# EAGLE design sdi-master (EAGLE 9.3.0)
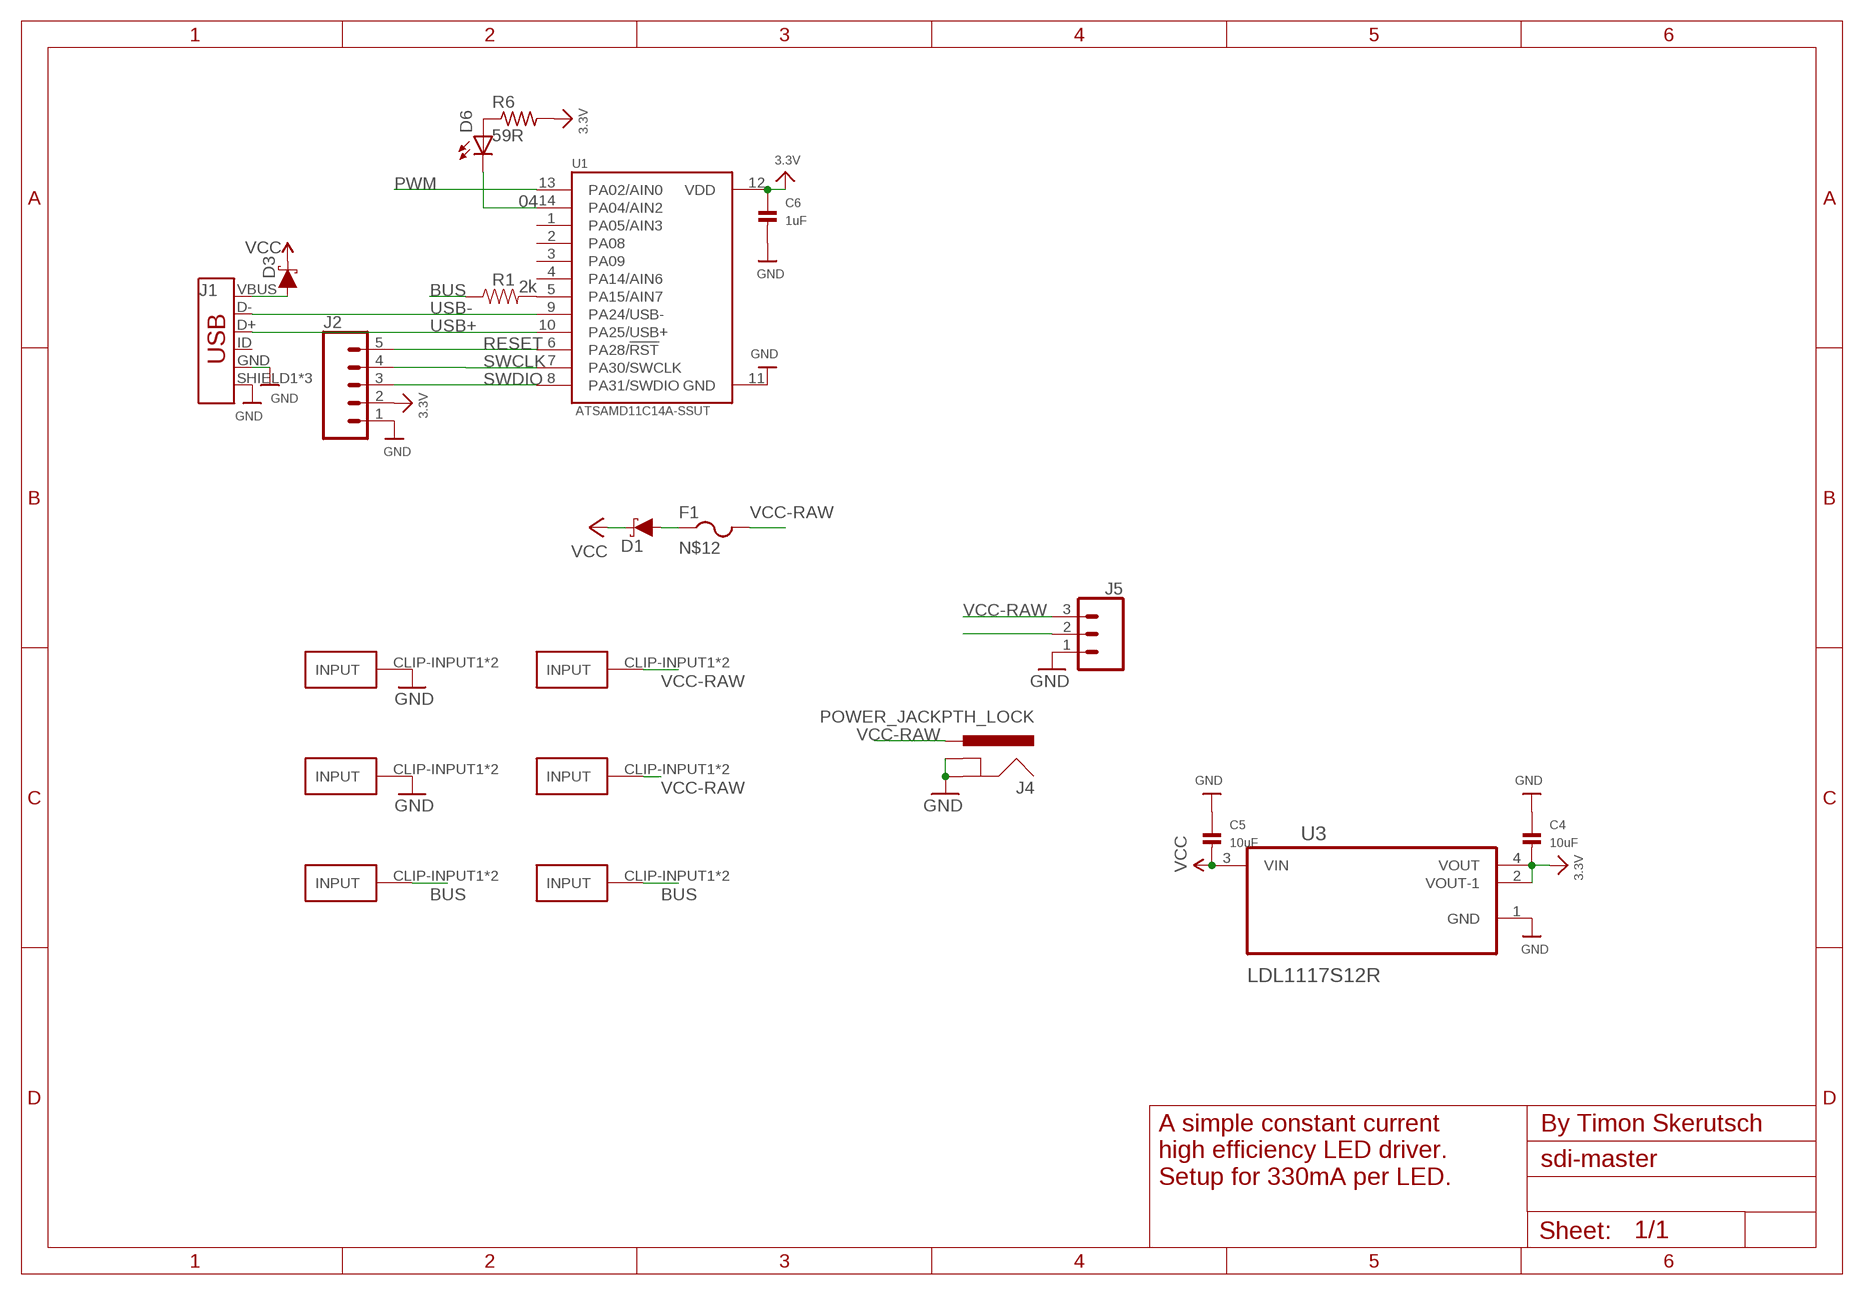
[diagram p0: schematic, sheet 1]

## Parts
C4  10uF  CAP_CERAMIC0805  [0805]
C5  10uF  CAP_CERAMIC0603  [0603]
C6  1uF  CAP_CERAMIC0603  [0603]
D1  3A/40V/500mV  DIODE-SCHOTTKY-B340A  [SMA-DIODE]
D3  3A/40V/500mV  DIODE-SCHOTTKY-B340A  [SMA-DIODE]
D6  LEDCHIPLED_0805  [CHIPLED_0805]
F1  TLC-MSMD110/24  PTCFUSE-1812  [1812]
GND-CLIP  FUSE-HOLDER-5X20MM  [FUSE-HOLDER-5X20MM]
GND-CLIP3  FUSE-HOLDER-5X20MM  [FUSE-HOLDER-5X20MM]
J1  USB_MICRO-B_FEMALE-SMT  [USB-B-MICRO-SMD]
J2  CONN_05  [1X05]
J4  POWER_JACKPTH_LOCK  [POWER_JACK_PTH_LOCK]
J5  CONN_03SCREW-NS  [SCREWTERMINAL-3.5MM-3-NS]
PWM-CLIP  FUSE-HOLDER-5X20MM  [FUSE-HOLDER-5X20MM]
PWM-CLIP1  FUSE-HOLDER-5X20MM  [FUSE-HOLDER-5X20MM]
R1  2k  RESISTOR1206  [1206]
R6  59R  R-US_R0805  [R0805]
U1  ATSAMD11C14A-SSUT  [SOIC127P600X160-14N]
U3  LDL1117S12R  [SOT230P700X180-4N]
VCC-CLIP  FUSE-HOLDER-5X20MM  [FUSE-HOLDER-5X20MM]
VCC-CLIP3  FUSE-HOLDER-5X20MM  [FUSE-HOLDER-5X20MM]

## Nets
3.3V [VCC]: C4.2 C6.1 J2.2 R6.2 U1.12(VDD) U3.2(VOUT-1) U3.4(VOUT)
04: D6.C U1.14(PA04/AIN2)
BUS: J5.2 PWM-CLIP1.CLIP-INPUT1(INPUT) PWM-CLIP1.CLIP-INPUT2(INPUT) PWM-CLIP.CLIP-INPUT1(INPUT) PWM-CLIP.CLIP-INPUT2(INPUT) R1.1
GND: C4.1 C5.1 C6.2 GND-CLIP3.CLIP-INPUT1(INPUT) GND-CLIP3.CLIP-INPUT2(INPUT) GND-CLIP.CLIP-INPUT1(INPUT) GND-CLIP.CLIP-INPUT2(INPUT) J1.GND J1.SHIELD1(SHIELD) J1.SHIELD2(SHIELD) J1.SHIELD3(SHIELD) J2.1 J4.GND J4.GNDBREAK J5.1 U1.11(GND) U3.1(GND)
N$4 [VCC]: D3.A J1.VBUS
N$5: R1.2 U1.5(PA15/AIN7)
N$6: D6.A R6.1
N$12 [VCC]: D1.A F1.1
PWM: U1.13(PA02/AIN0)
RESET: J2.5 U1.6(PA28/!RST)
SWCLK: J2.4 U1.7(PA30/SWCLK)
SWDIO: J2.3 U1.8(PA31/SWDIO)
USB+: J1.D+ U1.10(PA25/USB+)
USB-: J1.D- U1.9(PA24/USB-)
VCC [VCC]: C5.2 D1.C D3.C U3.3(VIN)
VCC-RAW [VCC]: F1.2 J4.PWR J5.3 VCC-CLIP3.CLIP-INPUT1(INPUT) VCC-CLIP3.CLIP-INPUT2(INPUT) VCC-CLIP.CLIP-INPUT1(INPUT) VCC-CLIP.CLIP-INPUT2(INPUT)
Unconnected: J1.ID U1.1(PA05/AIN3) U1.2(PA08) U1.3(PA09) U1.4(PA14/AIN6)

## Notes on the sheet
- By Timon Skerutsch
- A simple constant current
  high efficiency LED driver.
  Setup for 330mA per LED.

## Library data of the parts
C4-C6 = microbuilder:CAP_CERAMIC: Ceramic Capacitors 0402 - 0402 Surface Mount Capacitors 16pF 50V 5% [Digikey: 445-4899-2-ND] 18pF 50V 5% [Digikey: 490-1281-2-ND] 22pF 50V 5% [Digikey: 490-1283-2-ND] 68pF 50V 5% [Digikey: 490-1289-2-ND] 0.1uF 10V 10% [Digikey: 490-1318-2-ND] 1.0uF 6.3V 10% [Digikey: 490-1320-2-ND] 0603 - 0603 Surface Mount Capacitors 16 pF 50V 5% [Digikey: 445-5051-2-ND] 22 pF 50V [Digikey: PCC220ACVTR-ND] 33 pF 50V 5% [Digikey: 490-1415-1-ND] 56pF 50V 5% [Digikey: 490-1421-1-ND] 220pF 50V 5% [Digikey: 445-1285-1-ND] 680 pF 50V 2200 pF 50V 5% C0G [Digikey: 445-1297-1-ND] 5600 pF 100V 5% X7R [Digikey: 478-3711-1-ND] 0.1 µF 25V 10% [Digikey: PCC2277TR-ND] 0.22 µF 16V 10% X7R [Digikey: 445-1318-1-ND] 1.0 µF 25V 10% [Digikey: 445-5146-2-ND] 0603 - RF Specific 3pF 250V +/-0.1pF RF [Digikey: 712-1347-1-ND] 18 pF 250V 5% [Digikey: 478-3505-1-ND or 712-1322-1-ND] 56 pF 250V 5% C0G RF [Digikey: 490-4867-1-ND] 68 pF 250V RF [Digikey: 490-4868-1-ND] 0805 - 0805 Surface Mount Capacitors 220 pF 250V 2% RF Ceramic Capacitor [Digikey: 712-1398-1-ND] 1000 pF 50V 2% NP0 Ceramic Capacitor [Digikey: 478-3760-1-ND] 0.1 µF 25V 10% Ceramic Capacitor [Digikey: PCC1828TR-ND] 1.0 µF 16V 10% Ceramic Capacitor[Digikey: 490-1691-2-ND] 10.0 µF 10V 10% Ceramic Capacitor[Digikey: 709-1228-1-ND] 10.0 uF 16V 10% Ceramic Capacitor [Digikey: 478-5165-2-ND] 47 uF 6.3V 20% Ceramic Capacitor [Digikey: 587-1779-1-ND or 399-5506-1-ND] 1206 - 1206 Surface Mount Capacitors 47uF 10V 20% Ceramic Capacitor [Digikey: 490-5528-1-ND or 399-5508-1-ND or 445-6010-1-ND] 100uF 6.3V -20%, +80% Y5V Ceramic Capacitor (Digikey: 490-4512-1-ND, Mouser: 81-GRM31CF50J107ZE1L)
D1 D3 = SparkFun-DiscreteSemi:DIODE-SCHOTTKY: Schottky diode A Schottky diode is a semiconductor diode which has a low forward voltage drop and a very fast switching action.; PROD_ID: DIO-09886
D6 = Adafruit:LED: LED OSRAM: - CHIPLED LG R971, LG N971, LY N971, LG Q971, LY Q971, LO R971, LY R971 LH N974, LH R974 LS Q976, LO Q976, LY Q976 LO Q996 - Hyper CHIPLED LW Q18S LB Q993, LB Q99A, LB R99A - SideLED LS A670, LO A670, LY A670, LG A670, LP A670 LB A673, LV A673, LT A673, LW A673 LH A674 LY A675 LS A676, LA A676, LO A676, LY A676, LW A676 LS A679, LY A679, LG A679 - Hyper Micro SIDELED® LS Y876, LA Y876, LO Y876, LY Y876 LT Y87S - SmartLED LW L88C, LW L88S LB L89C, LB L89S, LG L890 LS L89K, LO L89K, LY L89K LS L896, LA L896, LO L896, LY L896 - TOPLED LS T670, LO T670, LY T670, LG T670, LP T670 LSG T670, LSP T670, LSY T670, LOP T670, LYG T670 LG T671, LOG T671, LSG T671 LB T673, LV T673, LT T673, LW T673 LH T674 LS T676, LA T676, LO T676, LY T676, LB T676, LH T676, LSB T676, LW T676 LB T67C, LV T67C, LT T67C, LS T67K, LO T67K, LY T67K, LW E67C LS E67B, LA E67B, LO E67B, LY E67B, LB E67C, LV E67C, LT E67C LW T67C LS T679, LY T679, LG T679 LS T770, LO T770, LY T770, LG T770, LP T770 LB T773, LV T773, LT T773, LW T773 LH T774 LS E675, LA E675, LY E675, LS T675 LS T776, LA T776, LO T776, LY T776, LB T776 LHGB T686 LT T68C, LB T68C - Hyper Mini TOPLED® LB M676 - Mini TOPLED Santana® LG M470 LS M47K, LO M47K, LY M47K Source: http://www.osram.convergy.de/
F1 = Adafruit:PTCFUSE: PTC fuses, resettable thermistors
GND-CLIP GND-CLIP3 PWM-CLIP PWM-CLIP1 VCC-CLIP VCC-CLIP3 = timon-diverses:FUSE-HOLDER-5X20MM
J1 = SparkFun-Connectors:USB_MICRO-B: USB Type Micro-B Connector Male/female and PTH/SMT variants SparkFun Products: SparkFun microB USB Breakout <https://www.sparkfun.com/products/12035> SparkFun USB microB Plug Breakout <https://www.sparkfun.com/products/10031> SparkFun ESP8266 Thing <https://www.sparkfun.com/products/13231>; PROD_ID: CONN-11752
J2 = SparkFun-Connectors:CONN_05: Multi connection point. Often used as Generic Header-pin footprint for 0.1 inch spaced/style header connections On any of the 0.1 inch spaced packages, you can populate with these: Break Away Headers - Straight <https://www.sparkfun.com/products/116> (PRT-00116) Break Away Male Headers - Right Angle <https://www.sparkfun.com/products/553> (PRT-00553) Female Headers <https://www.sparkfun.com/products/115> (PRT-00115) Break Away Headers - Machine Pin <https://www.sparkfun.com/products/117> (PRT-00117) Break Away Female Headers - Swiss Machine Pin <https://www.sparkfun.com/products/743> (PRT-00743) For SCREWTERMINALS and SPRING TERMINALS visit here: Screw Terimnals on SparkFun.com <https://www.sparkfun.com/search/results?term=Screw+Terminals> (5mm/3.5mm/2.54mm spacing) This device is also useful as a general connection point to wire up your design to another part of your project. Our various solder wires solder well into these plated through hole pads. Hook-Up Wire - Assortment (Stranded, 22 AWG) <https://www.sparkfun.com/products/11375> (PRT-11375) Hook-Up Wire - Assortment (Solid Core, 22 AWG) <https://www.sparkfun.com/products/11367> (PRT-11367) View the entire wire category on our website here <https://www.sparkfun.com/categories/141> Special notes: Molex polarized connector foot print use with SKU : PRT-08231 with associated crimp pins and housings. 1MM SMD Version SKU: PRT-10208
J4 = SparkFun-Connectors:POWER_JACK: Power Jack Connector This is the standard 5.5mm barrel jack for power. The PTH is the most common, proven, reliable, footprint. The Slot footprint only works if the mill layer is transmitted to the PCB fab house so be warned. Here are the connectors we sell at SparkFun: DC Barrel Power Jack/Connector <https://www.sparkfun.com/products/119> (PRT-00119) DC Barrel Power Jack/Connector (SMD) <https://www.sparkfun.com/products/12748> (PRT-12748) DC Barrel Jack Adapter - Breadboard Compatible <https://www.sparkfun.com/products/10811> (PRT-10811) It is used on this SparkFun product (and many, many others): SparkFun RedBoard - Programmed with Arduino <https://www.sparkfun.com/products/12757> (DEV-12757) Also, if you need a mating power supply or connector, please check these out: Wall Adapter Power Supply - 9VDC 650mA <https://www.sparkfun.com/products/298> (TOL-00298) DC Barrel Jack Adapter - Male <https://www.sparkfun.com/products/10287> (PRT-10287); PROD_ID: CONN-08197; SF_ID: PRT-00119
J5 = SparkFun-Connectors:CONN_03: Multi connection point. Often used as Generic Header-pin footprint for 0.1 inch spaced/style header connections On any of the 0.1 inch spaced packages, you can populate with these: Break Away Headers - Straight <https://www.sparkfun.com/products/116> (PRT-00116) Break Away Male Headers - Right Angle <https://www.sparkfun.com/products/553> (PRT-00553) Female Headers <https://www.sparkfun.com/products/115> (PRT-00115) Break Away Headers - Machine Pin <https://www.sparkfun.com/products/117> (PRT-00117) Break Away Female Headers - Swiss Machine Pin <https://www.sparkfun.com/products/743> (PRT-00743) Stackable Header - 3 Pin (Female, 0.1") <https://www.sparkfun.com/products/13875> (PRT-13875) For SCREWTERMINALS and SPRING TERMINALS visit here: Screw Terimnals on SparkFun.com <https://www.sparkfun.com/search/results?term=Screw+Terminals> (5mm/3.5mm/2.54mm spacing) This device is also useful as a general connection point to wire up your design to another part of your project. Our various solder wires solder well into these plated through hole pads. Hook-Up Wire - Assortment (Stranded, 22 AWG) <https://www.sparkfun.com/products/11375> (PRT-11375) Hook-Up Wire - Assortment (Solid Core, 22 AWG) <https://www.sparkfun.com/products/11367> (PRT-11367) View the entire wire category on our website here <https://www.sparkfun.com/categories/141> Special notes: Molex polarized connector foot print use with SKU : PRT-08232 with associated crimp pins and housings.
R1 = SparkFun-Resistors:RESISTOR: Resistor Basic schematic elements and footprints for 0603, 1206, and PTH resistors.
R6 = Adafruit:R-US_: RESISTOR, American symbol
U1 = ATSAMD11C14A-SSUT:ATSAMD11C14A-SSUT: MCU 32-Bit SAM D11 ARM Cortex M0+ RISC 16KB Flash 1.8V/2.5V/3.3V 14-Pin SOIC T/R; AVAILABILITY: Good; DESCRIPTION: Cortex-M0+, 16KB FLASH, 4KB SRAM, USB - 14 SOIC, INDUSTRIAL, GREEN, 1.6-3.6V, 48MHz/ SOIC .150 (SS); MF: Microchip; MP: ATSAMD11C14A-SSUT; PACKAGE: SOIC-14 Microchip; PRICE: 1.18 USD
U3 = LDL1117S12R:LDL1117S12R: None; AVAILABILITY: Good; DESCRIPTION: 1.2 A High PSRR low dropout linear voltage regulator; MF: STMicroelectronics; MP: LDL1117S12R; PACKAGE: SOT-223 STMicroelectronics; PRICE: 0.22 USD

## Net classes
1 VCC: clearance 0.254 mm

## Board
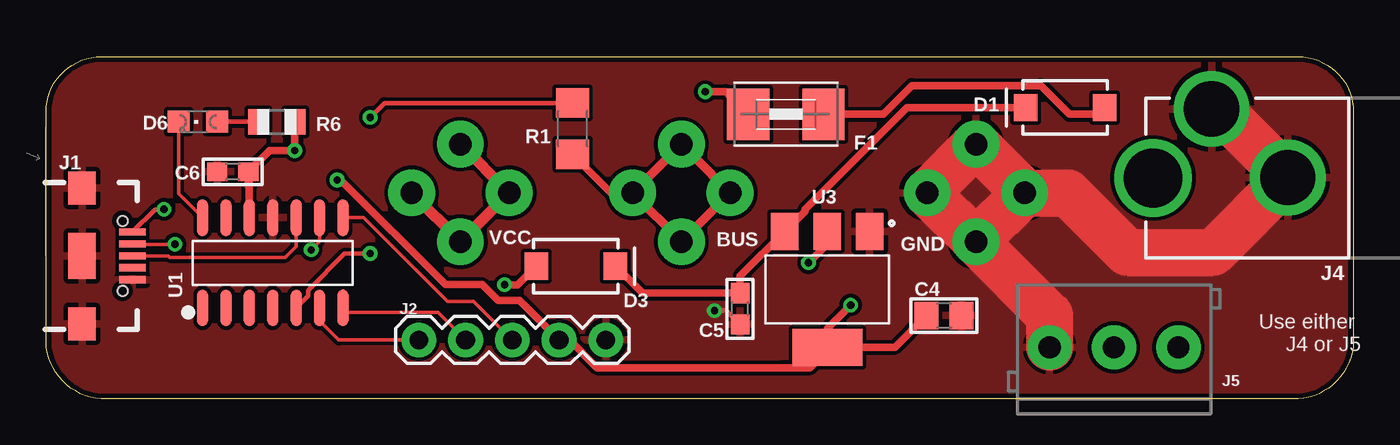
[diagram p1: board, top side]
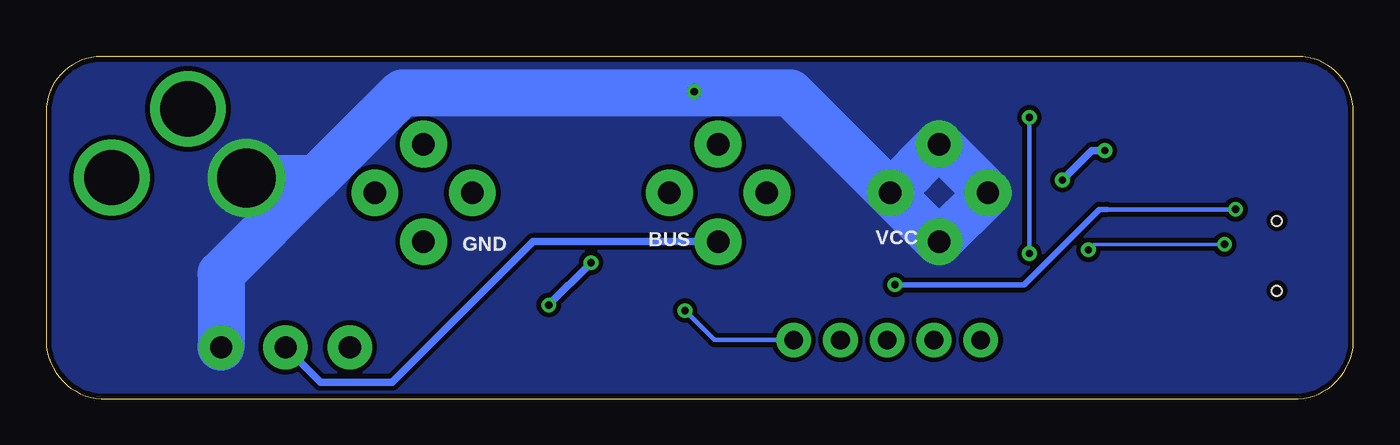
[diagram p2: board, bottom side, seen from below]

Size 71.01 x 18.6 mm. Coordinates in mm from the lower left corner, seen from the top.
Outline: 0,3.4 0,15.6 arc-90 3,18.6 68,18.6 arc-90 71,15.6 71,3.4 arc-90 68,0 3,0 arc-90 0,3.4
Copper layers (1*16): Top 0.035mm / dielectric 1.5mm / Bottom 0.035mm
Design rules "adafruit-modified-for-pcb-ng *": minimum track width 8mil, minimum drill 15.5mil, track to track 8mil, track to pad 8mil, pad to pad 8mil, via to via 8mil, smd to smd 0mil, copper to edge 11mil, drill to drill 8mil, minimum pad ring 10mil, minimum via ring 8mil, stop-mask expansion 0.116840625mm, vias tented up to drill 20mil, thermal gap 10mil

### Footprints (pad centres in the part's own frame; a part is rotated, then mirrored left to right if it is on the bottom)
0805 = smd 1.3 x 1.5: 1 -0.95,0; 2 0.95,0
0603 = smd 1.1 x 1: 1 -0.85,0; 2 0.85,0
SMA-DIODE = smd 1.27 x 1.47: A -2.15,0; C 2.15,0
CHIPLED_0805 = smd 1.2 x 1.2: A 0,-1.05; C 0,1.05
1812 = smd 2.286 x 2.794: 1 -2.046,0; 2 2.046,0
FUSE-HOLDER-5X20MM = drill 1.22 pad 2.54: CLIP-INPUT1 -2.65,0; CLIP-INPUT2 2.65,0
USB-B-MICRO-SMD = smd 1.45 x 0.4: D+ 2.725,0; D- 2.725,0.65; GND 2.725,-1.3; ID 2.725,-0.65; VBUS 2.725,1.3 | smd 1.5 x 1.8: SHIELD1 0,3.685; SHIELD2 0,-3.685 | smd 1.5 x 2.5: SHIELD3 0,0 | hole 0.55: 2.2,1.9; 2.2,-1.9
1X05 = drill 1.016 pad 1.88: 1 0,0; 2 2.54,0; 3 5.08,0; 4 7.62,0; 5 10.16,0
POWER_JACK_PTH_LOCK = drill 2.997 pad 4.115: GND 0.025,6.557; GNDBREAK 3.762,10.7 | drill 3.2 pad 4.115: PWR 0,13.878
SCREWTERMINAL-3.5MM-3-NS = drill 1.2 pad 2.413: 1 0,0; 2 3.5,0; 3 7,0
1206 = smd 1.6 x 1.8: 1 -1.4,0; 2 1.4,0
R0805 = smd 1.1 x 1.4: 1 -1,0; 2 1,0
SOIC127P600X160-14N = smd 2 x 0.6: 1 -2.45,3.81; 2 -2.45,2.54; 3 -2.45,1.27; 4 -2.45,0; 5 -2.45,-1.27; 6 -2.45,-2.54; 7 -2.45,-3.81; 8 2.45,-3.81; 9 2.45,-2.54; 10 2.45,-1.27; 11 2.45,0; 12 2.45,1.27; 13 2.45,2.54; 14 2.45,3.81
SOT230P700X180-4N = smd 1.5 x 2: 1 -2.3,-3.15; 2 0,-3.15; 3 2.3,-3.15 | smd 3.8 x 2: 4 0,3.15

### Placement (x,y rotation side)
C4  48.77,4.52 180 top
C5  37.69,4.9 90 top
C6  10.14,12.35 180 top
D1  55.35,15.83 180 top
D3  28.78,7.21 0 top
D6  8.25,15.06 90 top
F1  40.18,15.47 180 top
GND-CLIP  50.5,11.2 0 bottom
GND-CLIP3  50.51,11.2 90 bottom
J1  1.96,7.77 0 top
J2  30.4,3.2 180 top
J4  74,12 90 top
J5  54.5,2.8 0 top
PWM-CLIP  34.5,11.2 0 bottom
PWM-CLIP1  34.51,11.2 90 bottom
R1  28.6,14.68 90 top
R6  12.54,15.06 0 top
U1  12.31,7.4 90 top
U3  42.43,5.95 180 top
VCC-CLIP  22.5,11.2 0 bottom
VCC-CLIP3  22.5,11.19 270 bottom

### Tracks (layer width: path | path; a pad name or v marks a point on that pad's centre or on a via)
3.3V  (via drill 0.39)
  Top 0.254: 42.21,2.59 41.32,1.7 40,1.7
  Top 0.406: U1.12 11.04,11.5 | 11.04,11.5 11.04,11.94 | R6.2 13.54,14.9 13.5,14.86 v13.5,13.5 12.14,13.5 C6.1 10.99,11.56 11.04,11.5 | 42.02,2.4 42.21,2.59 U3.4 | U3.4 42.6,2.8 | 42.6,2.8 46.1,2.8 C4.2 | 42.6,2.8 41.5,1.7 40,1.7 29.93,1.7 28.43,3.2 J2.2 25.72,5.34 24.55,5.34 23.68,6.22 21.69,6.22 16,11.9 v15.8,11.9 | U3.4 42.43,3.82 v43.7,5.1 | v41.4,7.4 42.43,8.42 U3.2
  Bottom 0.406: v15.8,11.9 14.2,13.5 v13.5,13.5 | v43.7,5.1 v41.4,7.4
04
  Top 0.203: U1.14 7.2,11.15 D6.C
BUS
  Top 0.305: PWM-CLIP.CLIP-INPUT1 37.21,11.26
  Top 0.406: R1.1 30.68,11.2 PWM-CLIP.CLIP-INPUT2
  Top 0.483: PWM-CLIP1.CLIP-INPUT2 | 37.21,11.26 37.21,11.25 PWM-CLIP1.CLIP-INPUT1 PWM-CLIP.CLIP-INPUT2 PWM-CLIP1.CLIP-INPUT2 | PWM-CLIP.CLIP-INPUT1 35.14,13.21 PWM-CLIP1.CLIP-INPUT2
  Bottom 0.406: PWM-CLIP1.CLIP-INPUT1 44.56,8.55 52.2,0.9 56.1,0.9 J5.2
GND  (via drill 0.39)
  Top 0.254: C5.1 36.94,4.8 v36.3,4.8
  Top 2.54: GND-CLIP3.CLIP-INPUT1 GND-CLIP.CLIP-INPUT2 GND-CLIP3.CLIP-INPUT2 GND-CLIP.CLIP-INPUT1 | GND-CLIP3.CLIP-INPUT1 GND-CLIP.CLIP-INPUT1 | GND-CLIP.CLIP-INPUT1 55.49,11.2 58.72,7.97 63.39,7.97 J4.GND 63.71,15.76 J4.GNDBREAK | GND-CLIP3.CLIP-INPUT1 54.5,4.55 J5.1
  Bottom 0.254: v36.3,4.8 34.7,3.2 J2.1
  pour Top (rank 2): -1.11,29.1 71.89,29.1 71.89,-15 -1.11,-15
N$4  (via drill 0.39)
  Top 0.254: v6.4,10.3 5.92,10.3 J1.VBUS
  Top 0.406: v24.9,6.2 25.61,6.2 D3.A
  Bottom 0.254: 13.4,10.3 v6.4,10.3
  Bottom 0.305: v24.9,6.2 17.9,6.2 13.8,10.3 13.4,10.3
N$5  (via drill 0.39)
  Top 0.254: U1.5 14.22,5.58 14.22,5.91 16.22,7.9 v17.6,7.9 | v17.6,15.3 18.38,16.08 R1.2
  Bottom 0.254: v17.6,7.9 v17.6,15.3
N$6
  Top 0.254: D6.A R6.1
N$12
  Top 0.406: 44.38,15.47 F1.1 45.47,15.47 47.02,17.03 54.02,17.03 55.57,15.47 57.14,15.47 D1.A
PWM
  Top 0.508: 9.76,9.86 U1.13
RESET
  Top 0.203: J2.5 15.9,3.2 14.85,4.25 U1.6
SWCLK
  Top 0.203: J2.4 21.28,4.7 16.37,4.7 U1.7
  Top 0.305: U1.7 16.12,5.82
SWDIO
  Top 0.203: J2.3 23.22,5.3 21.8,5.3 17.26,9.84 U1.8
USB+
  Top 0.203: J1.D+ 6.64,7.77 6.71,7.7 13,7.7 13.58,8.28 U1.10
USB-  (via drill 0.39)
  Top 0.203: J1.D- 4.71,8.4 v7,8.4 | v14.4,8.1 14.85,8.55 U1.9
  Bottom 0.203: v7,8.4 14.1,8.4 v14.4,8.1
VCC
  Top 0.406: D3.C 32.39,5.75 C5.2 37.69,6.67 U3.3 41.22,10.2 41.22,10.29 46.76,15.83 D1.C
VCC-RAW  (via drill 0.39)
  Top 0.406: v35.8,16.7 36.91,16.7 F1.2
  Top 0.483: VCC-CLIP3.CLIP-INPUT2 22.5,8.55 | VCC-CLIP.CLIP-INPUT1 25.04,11.09 25.04,11.31
  Top 0.61: VCC-CLIP3.CLIP-INPUT2 25.04,11.09 | VCC-CLIP3.CLIP-INPUT1 25.04,11.31 | VCC-CLIP.CLIP-INPUT2 22.5,8.55
  Bottom 0.406: 35.8,16.4 v35.8,16.7
  Bottom 2.54: J4.PWR 56.31,12 | 56.31,12 51.67,16.64 30.59,16.64 VCC-CLIP.CLIP-INPUT1 | VCC-CLIP.CLIP-INPUT1 VCC-CLIP3.CLIP-INPUT1 VCC-CLIP.CLIP-INPUT2 22.5,8.55 VCC-CLIP3.CLIP-INPUT2 VCC-CLIP.CLIP-INPUT1 | 56.31,12 61.5,6.8 J5.3
  pour Bottom (no thermals): -0.53,27.14 -0.53,-12.71 71.42,-12.71 71.42,27.14

### Text on the board
tNames: VCC | BUS | GND | Use either / J4 or J5
bNames: VCC | BUS | GND
routoute: GND BUS VCC